# EAGLE design Evergreen (EAGLE 6.5.0)
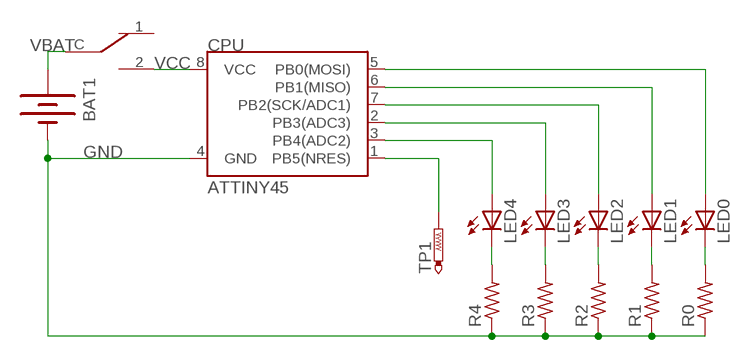
[diagram p0: schematic, sheet 1]

## Parts
BAT1  BATTERY20SMD  [BATTCON_20MM]
CPU  ATTINY45  [SO08-EIAJ]
LED0  LEDCHIP-LED0805  [CHIP-LED0805]
LED1  LEDCHIP-LED0805  [CHIP-LED0805]
LED2  LEDCHIP-LED0805  [CHIP-LED0805]
LED3  LEDCHIP-LED0805  [CHIP-LED0805]
LED4  LEDCHIP-LED0805  [CHIP-LED0805]
R0  R-US_M0805  [M0805]
R1  R-US_M0805  [M0805]
R2  R-US_M0805  [M0805]
R3  R-US_M0805  [M0805]
R4  R-US_M0805  [M0805]
SWITCH  SWITCH-SPDT  [SSAJ120100]
TP1  PTR1B2,54  [B2,54]

## Nets
GND: BAT1.2(-) CPU.4(GND) R0.1 R1.1 R2.1 R3.1 R4.1
N$10: LED4.C R4.2
N$11: LED3.C R3.2
N$12: LED2.C R2.2
N$13: LED1.C R1.2
N$14: LED0.C R0.2
PB0: CPU.5(PB0(MOSI)) LED0.A
PB1: CPU.6(PB1(MISO)) LED1.A
PB2: CPU.7(PB2(SCK/ADC1)) LED2.A
PB3: CPU.2(PB3(ADC3)) LED3.A
PB4: CPU.3(PB4(ADC2)) LED4.A
PB5: CPU.1(PB5(NRES)) TP1.TP
VBAT: BAT1.1(+) BAT1.3(+) SWITCH.C
VCC: CPU.8(VCC) SWITCH.2
Unconnected: SWITCH.1

## Library data of the parts
BAT1 = Robin:BATTERY: Battery Holders Various common sizes : AA, AAA, 20mm coin cell and 12mm coin cell.
CPU = SparkFun:ATTINY45: Atmel ATTiny45
LED0 LED1-LED4 = adafruit:LED: LED OSRAM: - CHIPLED LG R971, LG N971, LY N971, LG Q971, LY Q971, LO R971, LY R971 LH N974, LH R974 LS Q976, LO Q976, LY Q976 LO Q996 - Hyper CHIPLED LW Q18S LB Q993, LB Q99A, LB R99A - SideLED LS A670, LO A670, LY A670, LG A670, LP A670 LB A673, LV A673, LT A673, LW A673 LH A674 LY A675 LS A676, LA A676, LO A676, LY A676, LW A676 LS A679, LY A679, LG A679 - Hyper Micro SIDELED® LS Y876, LA Y876, LO Y876, LY Y876 LT Y87S - SmartLED LW L88C, LW L88S LB L89C, LB L89S, LG L890 LS L89K, LO L89K, LY L89K LS L896, LA L896, LO L896, LY L896 - TOPLED LS T670, LO T670, LY T670, LG T670, LP T670 LSG T670, LSP T670, LSY T670, LOP T670, LYG T670 LG T671, LOG T671, LSG T671 LB T673, LV T673, LT T673, LW T673 LH T674 LS T676, LA T676, LO T676, LY T676, LB T676, LH T676, LSB T676, LW T676 LB T67C, LV T67C, LT T67C, LS T67K, LO T67K, LY T67K, LW E67C LS E67B, LA E67B, LO E67B, LY E67B, LB E67C, LV E67C, LT E67C LW T67C LS T679, LY T679, LG T679 LS T770, LO T770, LY T770, LG T770, LP T770 LB T773, LV T773, LT T773, LW T773 LH T774 LS E675, LA E675, LY E675, LS T675 LS T776, LA T776, LO T776, LY T776, LB T776 LHGB T686 LT T68C, LB T68C - Hyper Mini TOPLED® LB M676 - Mini TOPLED Santana® LG M470 LS M47K, LO M47K, LY M47K Source: http://www.osram.convergy.de/
R0 R1-R4 = adafruit:R-US_: RESISTOR, American symbol
SWITCH = Robin:SWITCH-SPDT
TP1 = testpad:PTR1: TEST PIN

## Board
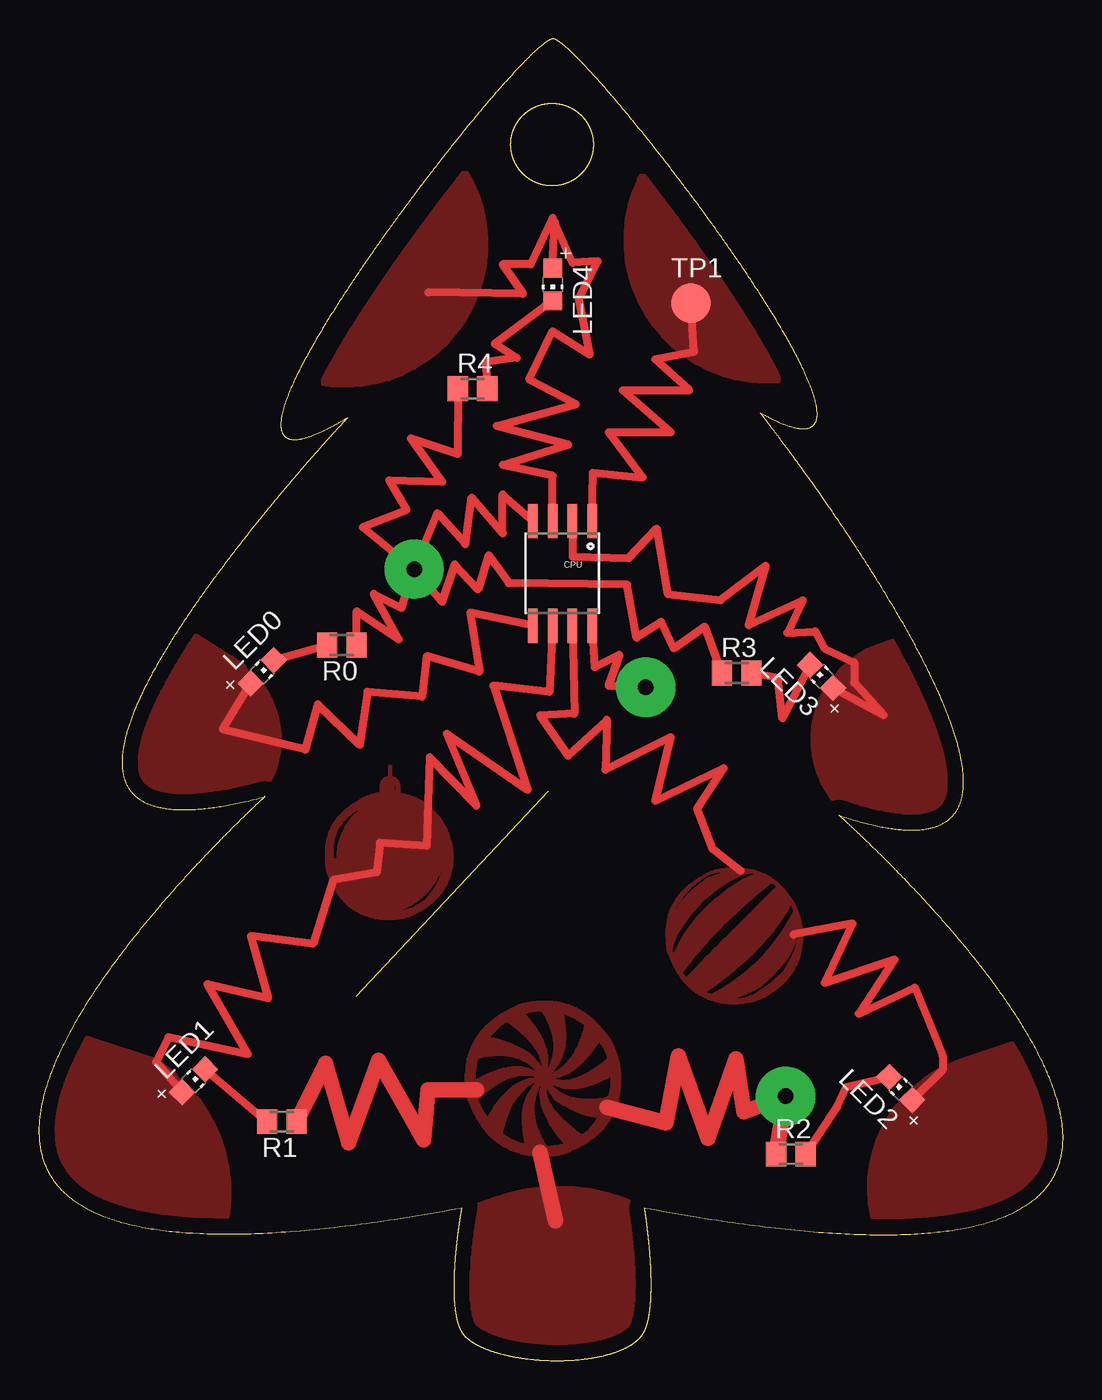
[diagram p1: board, top side]
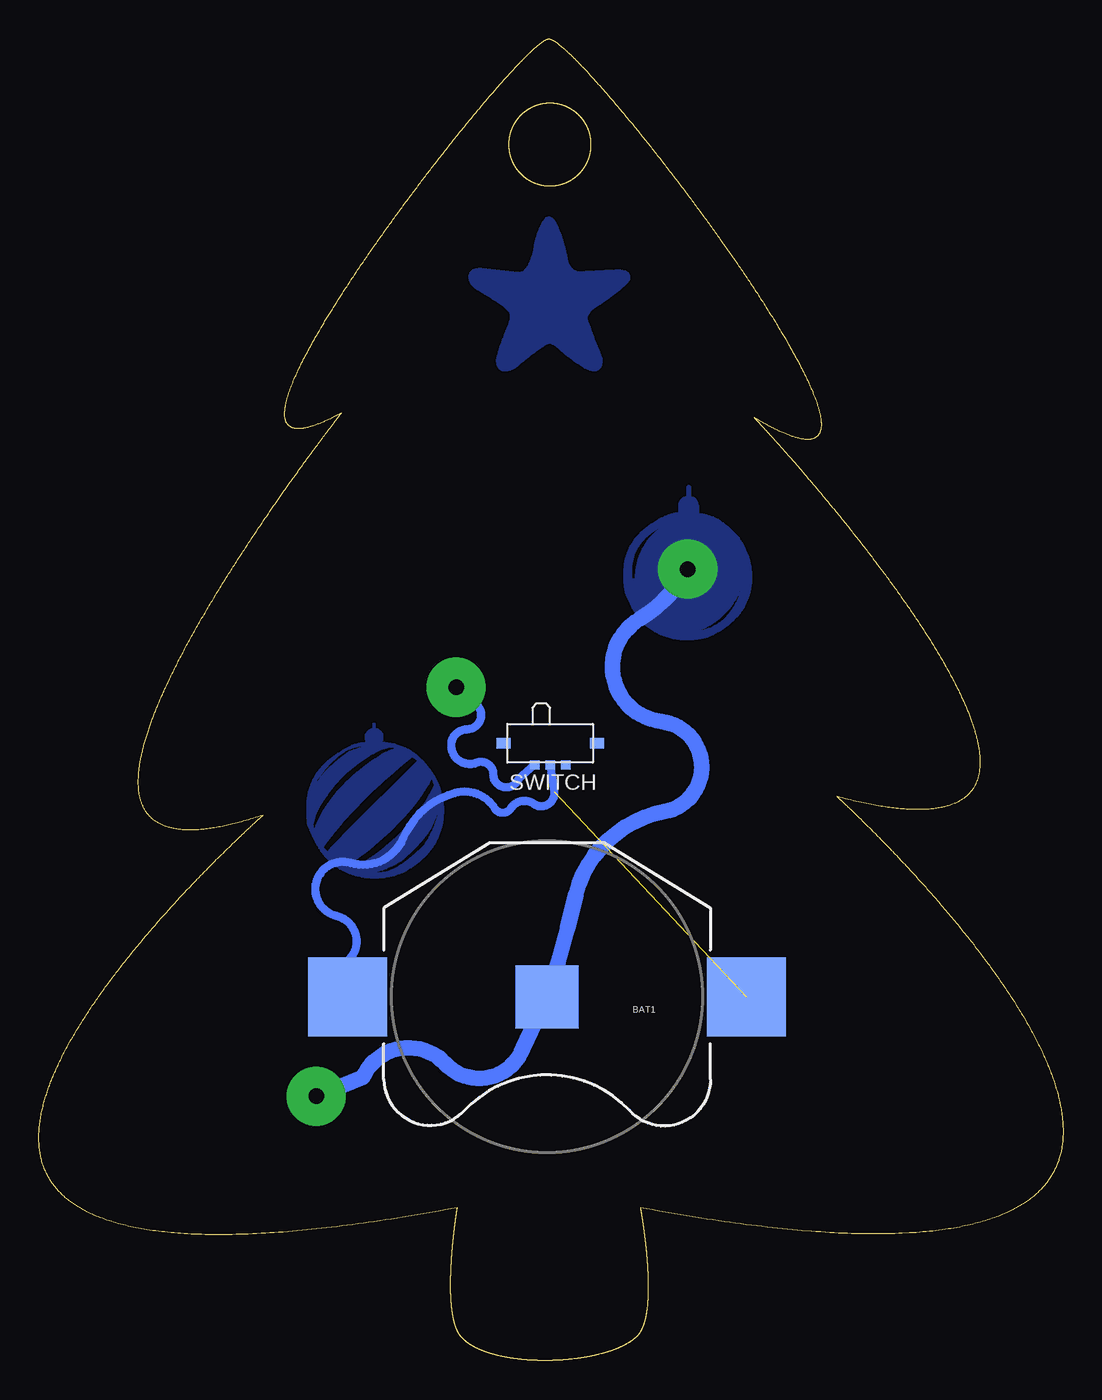
[diagram p2: board, bottom side, seen from below]

Size 65.87 x 85 mm. Coordinates in mm from the lower left corner, seen from the top.
Outline: 4836 segments
Copper layers (1*16): Top 0.035mm / dielectric 1.5mm / Bottom 0.035mm
Design rules "default *": minimum track width 10mil, minimum drill 24mil, track to track 0.15mm, track to pad 0.15mm, pad to pad 0.15mm, via to via 0.15mm, smd to smd 0.15mm, copper to edge 0.2mm, drill to drill 8mil, minimum pad ring 10mil, minimum via ring 8mil, stop-mask expansion 4mil, vias tented up to drill 0mil, thermal gap 10mil

### Footprints (pad centres in the part's own frame; a part is rotated, then mirrored left to right if it is on the bottom)
BATTCON_20MM = smd 5.08 x 5.08: 1 -12.827,0; 3 12.827,0 | smd 4.064 x 4.064: 2 0,0
SO08-EIAJ = smd 0.61 x 2.21: 1 -1.905,-3.378; 2 -0.635,-3.378; 3 0.635,-3.378; 4 1.905,-3.378; 5 1.905,3.353; 6 0.635,3.353; 7 -0.635,3.353; 8 -1.905,3.353
CHIP-LED0805 = smd 1.2 x 1.2: A 0,-1.05; C 0,1.05
M0805 = smd 1.3 x 1.6: 1 -0.95,0; 2 0.95,0
SSAJ120100 = smd 0.6 x 0.6: 1 -1,1.4; 2 1,1.4; C 0,1.4 | smd 0.9 x 0.7: P$1 -3,0; P$2 3,0
B2,54 = smd 2.54 x 2.54: TP 0,0

### Placement (x,y rotation side)
BAT1  33.19,23.4 180 bottom
CPU  33.68,50.61 180 top
LED0  14.37,44.3 315 top
LED1  9.96,18 315 top
LED2  55.43,17.5 45 top
LED3  50.34,44 45 top
LED4  33.05,69.2 180 top
R0  19.49,46.02 180 top
R1  15.63,15.37 180 top
R2  48.37,13.28 0 top
R3  44.88,44.22 0 top
R4  27.9,62.5 0 top
SWITCH  32.99,39.7 180 bottom
TP1  41.94,68 0 top
U$1  [ALIGN]  -1.16,87.4 0 top
U$2  [ALIGN]  67.34,-0.9 0 top

### Tracks (layer width: path | path; a pad name or v marks a point on that pad's centre or on a via)
GND  (via drill 1 pad 3.81)
  Top 0.5: v24.14,50.9 25.64,54.5 27.44,52.5 27.84,55.5 29.84,53.2 29.84,55.7 CPU.4 | R0.1 20.44,48.2 23.14,46.4 21.54,49.3 23.34,48.4 v24.14,50.9 | R4.1 26.94,58.3 23.94,59.3 25.94,56.5 22.54,56.6 23.64,54.7 20.84,53.6 v24.14,50.9 | R3.1 42.84,47.2 40.84,45.8 40.04,47.5 38.44,46.5 37.84,49.9 30.24,50 28.94,51.8 28.24,49.6 26.74,51.2 25.94,48.8 v24.14,50.9
  Top 1: R1.1 18.44,19.1 19.94,14 21.84,19.3 24.74,14.2 25.04,17.4 28.14,17.4 | 36.54,16.3 40.34,15.3 41.14,19.6 43.04,14.3 44.84,19.4 45.34,16 v48.04,17 R2.1 | 33.24,9 32.24,13.4
  Bottom 1: v24.14,50.9 arc31 27.24,47.7 arc-143 25.84,41.1 arc163 25.64,35.3 arc-65 31.34,30 arc6 BAT1.2 34.74,20.1 arc117 39.74,19.1 arc-113 45.04,18.2 v48.04,17
  pour Top (isolate 1.5, no thermals): 2688 corners
  pour Bottom (isolate 1.5, no thermals): 834 corners
  pour Top (isolate 1, no thermals): 20.24,7.3 29.44,10.5 arc-38 37.44,10.5 arc-35 43.74,5.8 arc-106 39.94,-6.3 arc-39 25.14,-6.3 arc-96 19.74,6.6
N$1
  pour Bottom (isolate 1.5, no thermals): 44.18,39.89 43.94,39.89 43.92,39.88 43.89,39.87 43.88,39.86 43.86,39.85 43.85,39.85 43.83,39.84 43.82,39.83 43.81,39.85 43.8,39.86 43.79,39.88 43.78,39.89 43.78,39.91 43.77,39.92 43.76,39.93 43.75,39.95 43.75,40.26 43.77,40.29 43.79,40.32 43.81,40.34 43.83,40.37 43.85,40.39 43.87,40.42 43.88,40.44 43.9,40.46 43.92,40.48 43.94,40.5 43.96,40.52 43.98,40.53 44,40.55 44.03,40.56 44.05,40.57 44.07,40.58 44.09,40.59 44.11,40.6 44.13,40.61 44.15,40.61 44.17,40.62 44.2,40.62 44.22,40.62 44.24,40.62 44.24,40.99 44.36,40.99 44.36,40.62 44.38,40.62 44.41,40.62 44.43,40.62 44.45,40.61 44.47,40.61 44.49,40.6 44.51,40.59 44.54,40.58 44.56,40.57 44.58,40.56 44.6,40.55 44.62,40.53 44.64,40.52 44.66,40.5 44.68,40.48 44.7,40.46 44.72,40.44 44.74,40.42 44.76,40.39 44.78,40.37 44.79,40.34 44.81,40.32 44.83,40.29 44.85,40.26 44.85,39.95 44.84,39.93 44.84,39.92 44.83,39.91 44.82,39.89 44.81,39.88 44.81,39.86 44.8,39.85 44.79,39.83 44.72,39.84 44.64,39.85 44.56,39.85 44.49,39.86 44.41,39.87 44.33,39.88 44.26,39.88
N$4
  pour Bottom (isolate 1.5, no thermals): 430 corners
N$6
  pour Top (isolate 1.5, no thermals): 44.79,31.79 45.03,31.79 45.05,31.78 45.08,31.77 45.09,31.76 45.11,31.75 45.12,31.75 45.14,31.74 45.15,31.73 45.16,31.75 45.17,31.76 45.18,31.78 45.19,31.79 45.19,31.81 45.2,31.82 45.21,31.83 45.22,31.85 45.22,32.16 45.2,32.19 45.18,32.22 45.16,32.24 45.14,32.27 45.12,32.29 45.11,32.32 45.09,32.34 45.07,32.36 45.05,32.38 45.03,32.4 45.01,32.42 44.99,32.43 44.97,32.45 44.95,32.46 44.92,32.47 44.9,32.48 44.88,32.49 44.86,32.5 44.84,32.51 44.82,32.51 44.8,32.52 44.77,32.52 44.75,32.52 44.73,32.52 44.73,32.89 44.61,32.89 44.61,32.52 44.59,32.52 44.56,32.52 44.54,32.52 44.52,32.51 44.5,32.51 44.48,32.5 44.46,32.49 44.44,32.48 44.41,32.47 44.39,32.46 44.37,32.45 44.35,32.43 44.33,32.42 44.31,32.4 44.29,32.38 44.27,32.36 44.25,32.34 44.23,32.32 44.21,32.29 44.2,32.27 44.18,32.24 44.16,32.22 44.14,32.19 44.12,32.16 44.12,31.85 44.13,31.83 44.14,31.82 44.14,31.81 44.15,31.79 44.16,31.78 44.16,31.76 44.17,31.75 44.18,31.73 44.25,31.74 44.33,31.75 44.41,31.75 44.48,31.76 44.56,31.77 44.64,31.78 44.71,31.78
N$10
  Top 0.5: R4.2 28.74,64.2 30.74,64.5 29.34,65.4 LED4.C
N$11
  Top 0.5: LED3.C 47.84,41.3 47.54,43.9 R3.2
N$12
  Top 0.5: R2.2 51.34,16.3 51.94,17.6 LED2.C
N$13
  Top 0.5: LED1.C R1.2
N$14
  Top 0.5: LED0.C R0.2
PB0
  Top 0.5: CPU.5 27.74,48.1 28.34,44.3 24.94,45.3 24.64,42.7 21.14,43 20.64,39.6 17.94,42.2 17.14,39.3 11.84,40.6 LED0.A
  pour Top (isolate 1, no thermals): 4.54,50.2 12.64,45.1 arc-48 15.44,40.9 arc-163 4.64,37.4 arc-52 4.54,49.8
PB1
  Top 0.5: CPU.6 32.84,43 29.24,43.4 31.44,36.7 26.24,40.3 28.14,35.7 25.14,38.8 24.94,33.1 21.94,33.3 21.74,31.4 18.94,30.9 17.64,26.8 13.64,27.3 14.74,23.3 10.84,24.2 13.44,19.7 8.34,20.8 7.54,19.2 LED1.A
  pour Top (isolate 1.5, no thermals): 834 corners
  pour Top (isolate 1, no thermals): -3.96,23.1 7.44,19.4 arc-87 11.04,5.9 arc-233
PB2
  Top 0.5: CPU.7 34.44,41.6 32.24,41.5 34.04,38.9 36.54,41.2 36.44,38 40.64,40.1 39.64,36 44.04,38.1 42.34,35.5 43.34,32.9 45.14,31.5 | LED2.A 58.14,18.7 58.14,19.6 56.34,24 52.74,22.3 55.04,25.8 50.54,24.3 52.34,28.1 48.54,27.4
  pour Top (isolate 1.5, no thermals): 1154 corners
  pour Top (isolate 1, no thermals): 70.04,22.9 59.24,19.3 arc95 54.04,7.7 arc219 70.24,22.8
PB3
  Top 0.5: CPU.2 34.34,51.7 37.94,51.6 39.74,53.5 40.44,49.3 43.84,48.9 46.74,51.1 45.64,47.3 49.14,48.9 48.14,46.8 49.94,46.9 50.54,45.8 52.44,44.9 52.44,43.6 54.34,41.5 LED3.A
  pour Top (isolate 1, no thermals): 63.34,49.5 54.34,46.1 arc145 53.94,34 arc52 66.24,36.5 arc141 64.04,49.6
PB4
  Top 0.5: CPU.3 33.04,56.9 29.84,57.6 34.04,58.9 29.44,60.1 34.54,61.5 31.54,63.1 33.04,66.2 35.44,64.7 34.74,68.3 35.94,70.7 34.34,70.6 33.17,73.22 | 33.17,73.22 33.04,73.5 31.64,70.5 29.84,70.5 31.14,68.6 25.04,68.7 | LED4.A 33.17,73.22
  pour Top (isolate 1.5, no thermals): 18.74,85.6 26.24,77.9 arc-201 11.34,68.4 arc-82 17.84,85
PB5
  Top 0.5: CPU.1 35.64,57.1 38.84,56.8 36.64,59.7 40.64,59.7 37.54,62.4 41.84,62.4 39.64,64.4 42.14,64.9 TP1.TP
  pour Top (isolate 1.5, no thermals): 47.74,85.9 40.24,78.2 arc201 55.14,68.7 arc82 48.64,85.3
VBAT  (1 unrouted)
  Bottom 0.5: SWITCH.C 32.74,36.6 arc134 34.04,35.8 arc-93 35.54,35.5 arc116 36.54,35.5 arc-73 39.14,36.5 arc-51 42.44,33.6 arc83 45.84,32 arc-183 46.74,28.6 arc131 46.14,25.6 arc-152 BAT1.3
  pour Bottom (isolate 1.5, no thermals): 1154 corners
VCC  (via drill 1 pad 3.81)
  Top 0.5: CPU.8 35.74,44.6 37.34,45.4 36.64,43.4 v39.04,43.3
  Bottom 0.5: SWITCH.2 35.04,37.4 arc166 36.64,37.8 arc-112 37.84,38.4 arc111 39.34,39.7 arc83 38.34,40.6 arc-160 38.04,42.4 arc45 v39.04,43.3